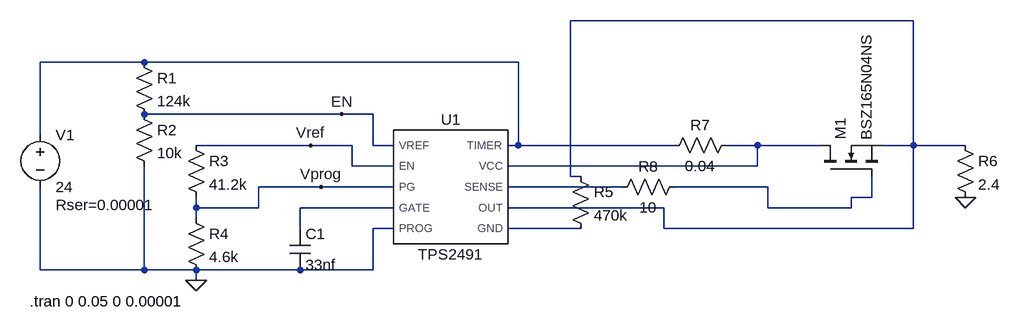
[diagram p0: schematic Draft1.asc]
Draft1.asc, the LTspice schematic file:
Version 4
SHEET 1 1636 680
WIRE 1200 -160 672 -160
WIRE 16 -96 -144 -96
WIRE 592 -96 16 -96
WIRE 320 -16 16 -16
WIRE 368 -16 320 -16
WIRE -144 16 -144 -96
WIRE 272 32 96 32
WIRE 336 32 272 32
WIRE 368 32 368 -16
WIRE 400 32 368 32
WIRE 592 32 592 -96
WIRE 592 32 576 32
WIRE 832 32 592 32
WIRE 960 32 912 32
WIRE 1056 32 960 32
WIRE 1200 32 1200 -160
WIRE 1200 32 1152 32
WIRE 1280 32 1200 32
WIRE 336 64 336 32
WIRE 400 64 336 64
WIRE 960 64 960 32
WIRE 960 64 576 64
WIRE 672 80 672 -160
WIRE 688 80 672 80
WIRE 288 96 192 96
WIRE 400 96 288 96
WIRE 752 96 576 96
WIRE 976 96 832 96
WIRE 1136 112 1136 80
WIRE 1136 112 1104 112
WIRE 96 128 96 112
WIRE 192 128 192 96
WIRE 192 128 96 128
WIRE 400 128 256 128
WIRE 816 128 576 128
WIRE 976 128 976 96
WIRE 1104 128 1104 112
WIRE 1104 128 976 128
WIRE 96 144 96 128
WIRE 256 160 256 128
WIRE 400 160 368 160
WIRE 688 160 576 160
WIRE 816 160 816 128
WIRE 1200 160 1200 32
WIRE 1200 160 816 160
WIRE -144 224 -144 96
WIRE 16 224 16 64
WIRE 16 224 -144 224
WIRE 96 224 16 224
WIRE 256 224 96 224
WIRE 368 224 368 160
WIRE 368 224 256 224
WIRE 96 240 96 224
FLAG 96 240 0
FLAG 320 -16 EN
FLAG 272 32 Vref
FLAG 288 96 Vprog
FLAG 1280 112 0
SYMBOL AutoGenerated\\TPS2491 480 96 R0
SYMATTR InstName U1
SYMBOL res 80 16 R0
SYMATTR InstName R3
SYMATTR Value 41.2k
SYMBOL res 80 128 R0
SYMATTR InstName R4
SYMATTR Value 4.6k
SYMATTR SpiceLine tol=1%
SYMBOL cap 240 160 R0
SYMATTR InstName C1
SYMATTR Value 33nf
SYMBOL voltage -144 0 R0
WINDOW 123 0 0 Left 0
WINDOW 39 24 124 Left 2
SYMATTR SpiceLine Rser=0.00001
SYMATTR InstName V1
SYMATTR Value 24
SYMBOL res 928 16 R90
WINDOW 0 0 56 VBottom 2
WINDOW 3 32 56 VTop 2
SYMATTR InstName R7
SYMATTR Value 0.04
SYMATTR SpiceLine tol=1
SYMBOL res 848 80 R90
WINDOW 0 0 56 VBottom 2
WINDOW 3 32 56 VTop 2
SYMATTR InstName R8
SYMATTR Value 10
SYMBOL nmos 1056 80 R270
SYMATTR InstName M1
SYMATTR Value BSZ165N04NS
SYMBOL res 0 -112 R0
SYMATTR InstName R1
SYMATTR Value 124k
SYMBOL res 0 -32 R0
SYMATTR InstName R2
SYMATTR Value 10k
SYMBOL res 672 64 R0
SYMATTR InstName R5
SYMATTR Value 470k
SYMBOL res 1264 16 R0
SYMATTR InstName R6
SYMATTR Value 2.4
TEXT -160 272 Left 2 !.tran 0 0.05 0 0.00001

The netlist it stands for:
* Draft1.asc
XU1 EN Vref Vprog N006 0 N002 N003 N004 N001 N007 TPS2491  ; pins VREF EN PG GATE PROG TIMER VCC SENSE OUT GND
R3 Vref Vprog 41.2k
R4 Vprog 0 4.6k tol=1%
C1 N006 0 33nf
V1 N002 0 24 Rser=0.00001
R7 N003 N002 0.04 tol=1
R8 N005 N004 10
M1 N003 N005 N001 N001 BSZ165N04NS
R1 N002 EN 124k
R2 EN 0 10k
R5 N001 N007 470k
R6 N001 0 2.4
.model NMOS NMOS
.model PMOS PMOS
.lib standard.mos
.tran 0 0.05 0 0.00001
.lib C:\Users\1\Documents\Robopro\Operator panel\PCB\Rozum\2.0.0\Simutlations\TPS2491 test\TPS2491_PSPICE_TRANS\tps2491.lib
.backanno
.end